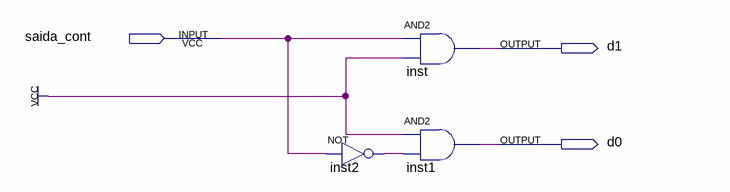
[diagram p0: schematic sheet]
// Quartus schematic demux_digito.bdf as structural Verilog: 3 symbols, 3 pins
module demux_digito (
  input  saida_cont,
  output d1,
  output d0
);

  wire inst2_out;

  not inst2 (inst2_out, saida_cont);
  and inst (d1, saida_cont, 1'b1);
  and inst1 (d0, 1'b1, inst2_out);
endmodule
